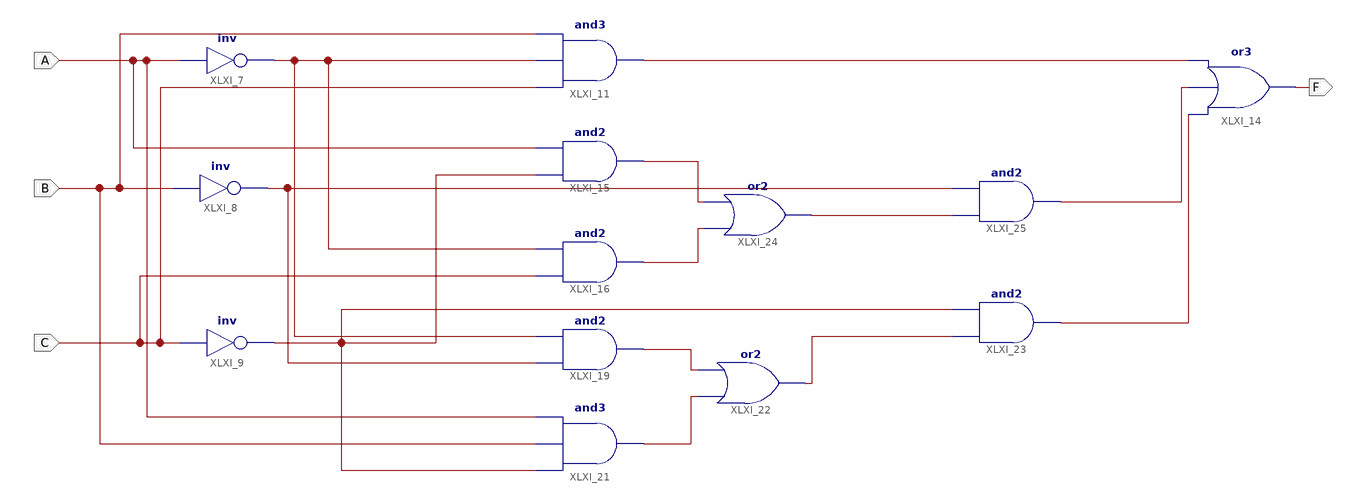
[diagram p0: schematic sheet 1]
// Xilinx ISE schematic Schematic.sch (artix7) as structural Verilog: 13 symbols, 4 ports
module Schematic (
  input  B,
  input  A,
  input  C,
  output F
);

  wire XLXN_25, XLXN_29, XLXN_30, XLXN_31, XLXN_32, XLXN_35, XLXN_37, XLXN_38, XLXN_40, XLXN_41, XLXN_42,
       XLXN_50;

  not XLXI_7 (XLXN_35, A);
  not XLXI_8 (XLXN_25, B);
  not XLXI_9 (XLXN_31, C);
  and XLXI_11 (XLXN_40, C, XLXN_35, B);
  or XLXI_14 (F, XLXN_42, XLXN_41, XLXN_40);
  and XLXI_15 (XLXN_37, XLXN_31, A);
  and XLXI_16 (XLXN_38, C, XLXN_35);
  and XLXI_19 (XLXN_29, XLXN_25, XLXN_35);
  and XLXI_21 (XLXN_30, XLXN_31, B, A);
  or XLXI_22 (XLXN_32, XLXN_30, XLXN_29);
  and XLXI_23 (XLXN_42, XLXN_32, XLXN_31);
  or XLXI_24 (XLXN_50, XLXN_38, XLXN_37);
  and XLXI_25 (XLXN_41, XLXN_50, XLXN_25);
endmodule
